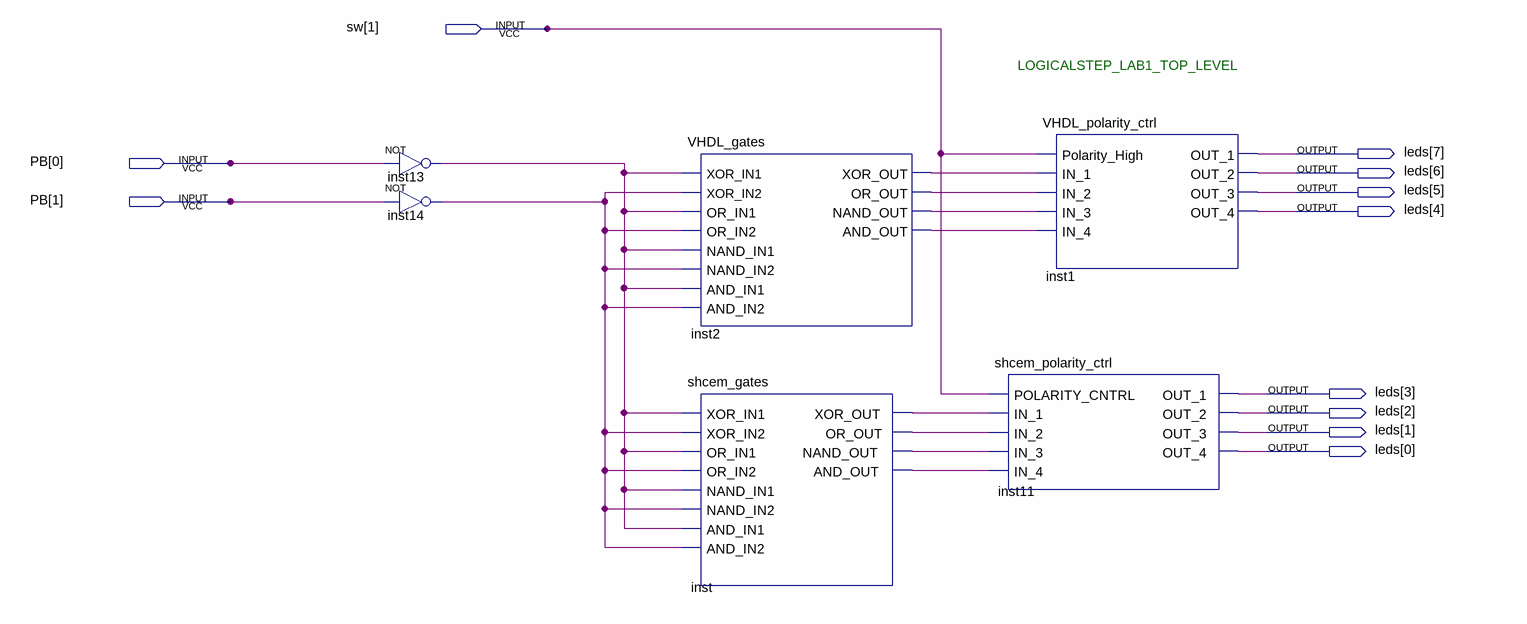
[diagram p0: schematic sheet]
// Quartus schematic LogicalStep_Lab1_top.bdf as structural Verilog: 6 symbols, 11 pins
module LogicalStep_Lab1_top (
  input  [1:1] sw,
  input  [1:0] PB,
  output [7:0] leds
);

  wire inst2_and_out, inst2_nand_out, inst2_or_out, inst2_xor_out, inst13_out, inst14_out, inst_and_out,
       inst_nand_out, inst_or_out, inst_xor_out;

  not inst13 (inst13_out, PB[0]);
  not inst14 (inst14_out, PB[1]);
  VHDL_gates inst2 (
    .XOR_IN1(inst13_out), .XOR_IN2(inst14_out), .OR_IN1(inst13_out), .OR_IN2(inst14_out),
    .NAND_IN1(inst13_out), .NAND_IN2(inst14_out), .AND_IN1(inst13_out), .AND_IN2(inst14_out),
    .XOR_OUT(inst2_xor_out), .OR_OUT(inst2_or_out), .NAND_OUT(inst2_nand_out), .AND_OUT(inst2_and_out));
  shcem_gates inst (
    .XOR_IN1(inst13_out), .XOR_IN2(inst14_out), .OR_IN1(inst13_out), .OR_IN2(inst14_out),
    .NAND_IN1(inst13_out), .NAND_IN2(inst14_out), .AND_IN1(inst13_out), .AND_IN2(inst14_out),
    .XOR_OUT(inst_xor_out), .OR_OUT(inst_or_out), .NAND_OUT(inst_nand_out), .AND_OUT(inst_and_out));
  VHDL_polarity_ctrl inst1 (
    .Polarity_High(sw[1]), .IN_1(inst2_xor_out), .IN_2(inst2_or_out), .IN_3(inst2_nand_out),
    .IN_4(inst2_and_out), .OUT_1(leds[7]), .OUT_2(leds[6]), .OUT_3(leds[5]), .OUT_4(leds[4]));
  shcem_polarity_ctrl inst11 (
    .POLARITY_CNTRL(sw[1]), .IN_1(inst_xor_out), .IN_2(inst_or_out), .IN_3(inst_nand_out),
    .IN_4(inst_and_out), .OUT_1(leds[3]), .OUT_2(leds[2]), .OUT_3(leds[1]), .OUT_4(leds[0]));

  // Notes on the sheet:
  //   LOGICALSTEP_LAB1_TOP_LEVEL
endmodule
